# EAGLE schematic radio_module (EAGLE 8.2.0)
AUTHOR: Joshua Adkins; REV: B; TITLE: Radio Module

## Sheet 1 of 6: Module Headers and SAM4L
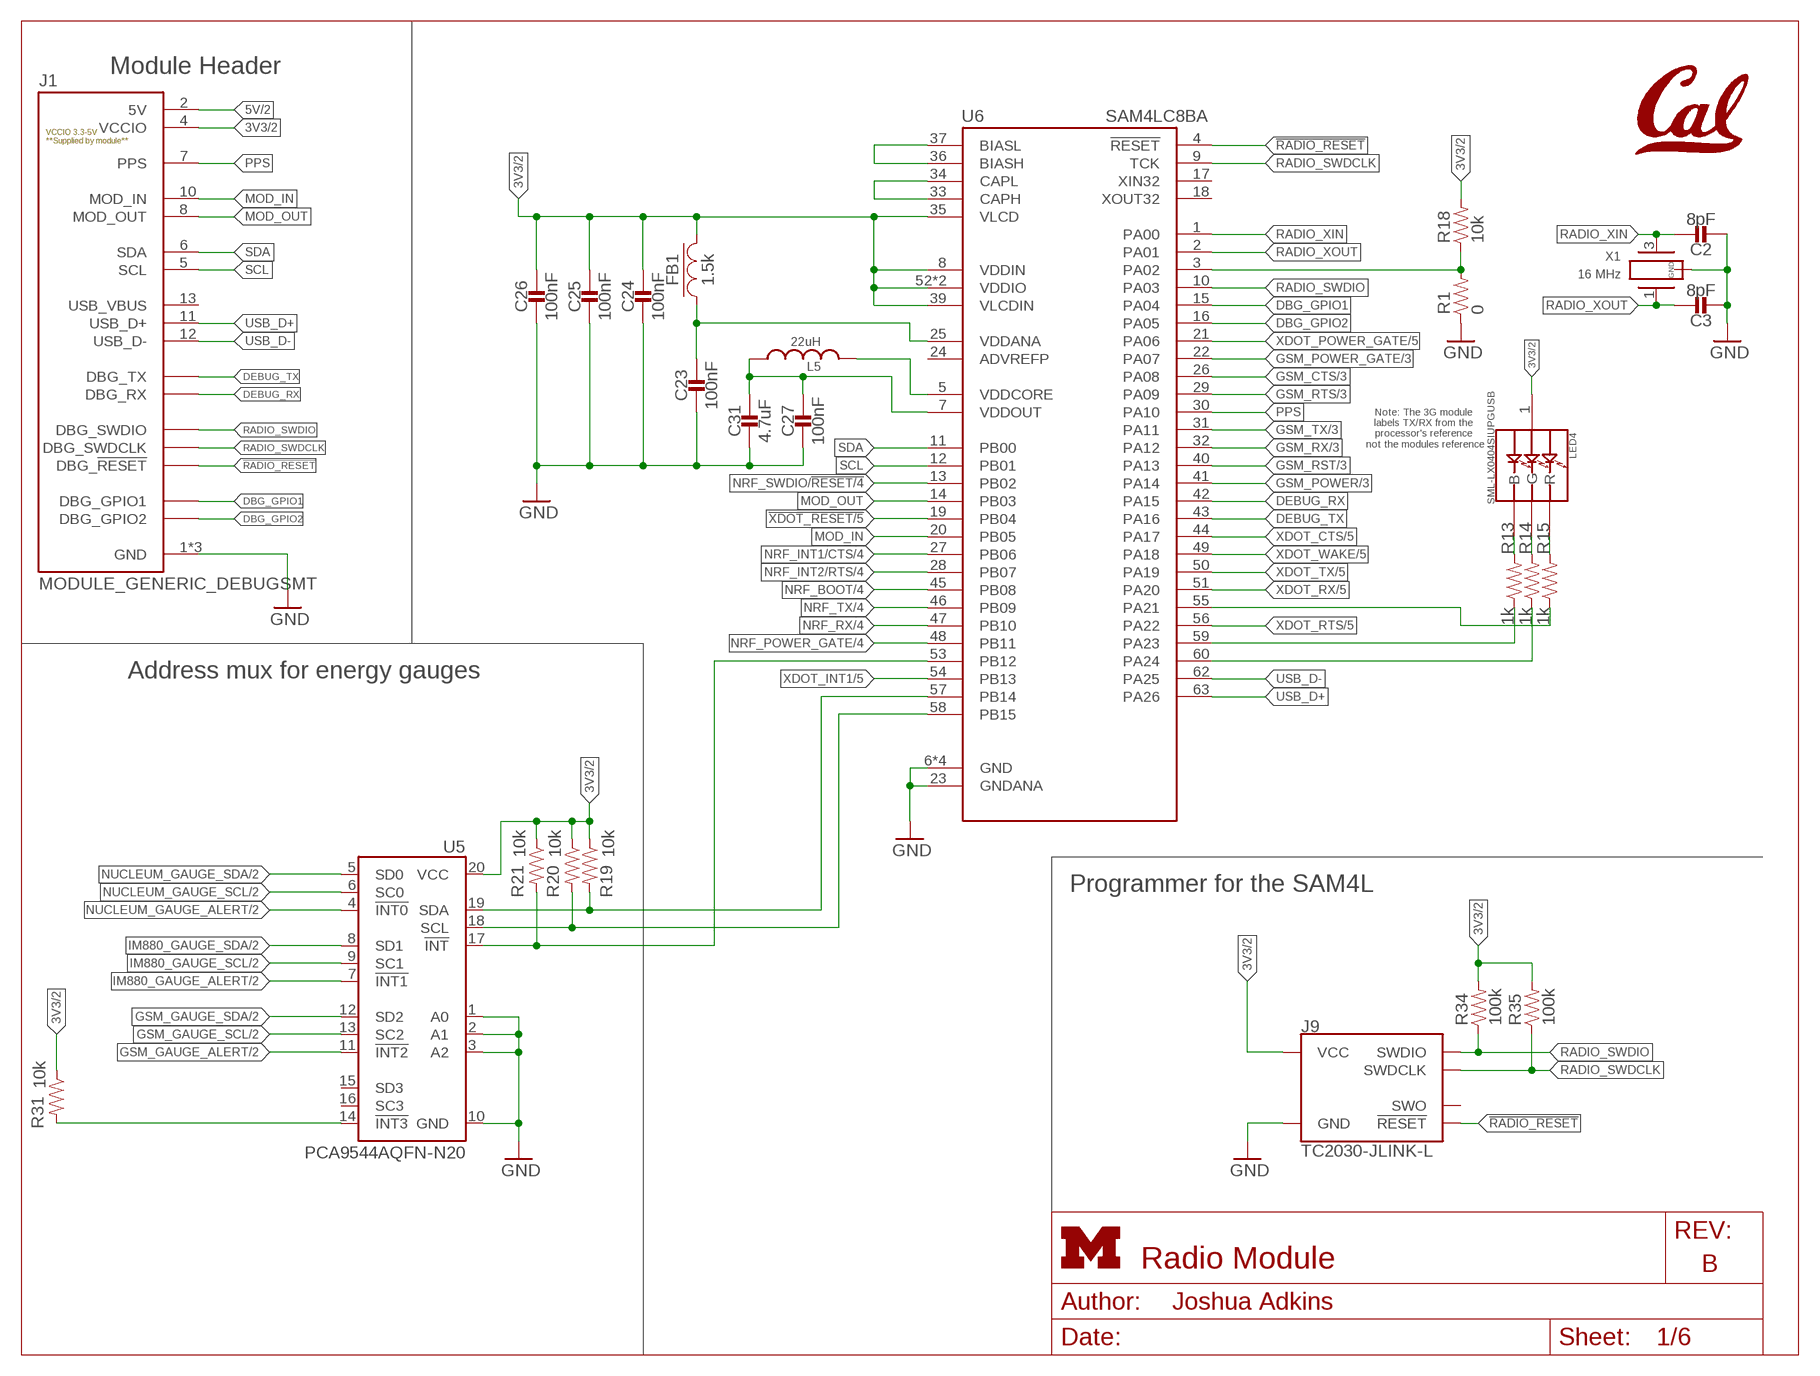
[diagram p0: schematic, sheet 1]
FRAME2 (LETTER_L_UMICH): HEIGHT: 8.5in; WIDTH: 11in

### Parts
C2  8pF  CAPACITOR0402_CAP  [0402_CAP]
C3  8pF  CAPACITOR0402_CAP  [0402_CAP]
C23  100nF  CAPACITOR0402_CAP  [0402_CAP]
C24  100nF  CAPACITOR0402_CAP  [0402_CAP]
C25  100nF  CAPACITOR0402_CAP  [0402_CAP]
C26  100nF  CAPACITOR0402_CAP  [0402_CAP]
C27  100nF  CAPACITOR0402_CAP  [0402_CAP]
C31  4.7uF  CAPACITOR0402_CAP  [0402_CAP]
FB1  1.5k  FERRITE_BEAD0402  [0402_CAP]
J1  MODULE_GENERIC_DEBUGSMT  [MODULE_GENERIC_DEBUG_SMT]
J9  TC2030-JLINK-L  [TC2030-IDC]
L5  22uH  LHQ3NP  [1212]
LED4  SML-LX0404SIUPGUSB  [1MM_SQ_4PAD]
R1  0  RESISTOR0402_RES  [0402_RES]
R13  1k  RESISTOR0402_RES  [0402_RES]
R14  1k  RESISTOR0402_RES  [0402_RES]
R15  1k  RESISTOR0402_RES  [0402_RES]
R18  10k  RESISTOR0402_RES  [0402_RES]
R19  10k  RESISTOR0402_RES  [0402_RES]
R20  10k  RESISTOR0402_RES  [0402_RES]
R21  10k  RESISTOR0402_RES  [0402_RES]
R31  10k  RESISTOR0402_RES  [0402_RES]
R34  100k  RESISTOR0402_RES  [0402_RES]
R35  100k  RESISTOR0402_RES  [0402_RES]
U5  PCA9544AQFN-N20  [QFN-N20]
U6  SAM4LC8BA  [QFN-64-9MM]
U$1  UCB_CAL100MIL  [UCB_CAL_100MIL]
X1  16 MHz  FH1600015  [FHXXX]

### Nets
3V3: C24.1 C25.1 C26.1 FB1.2 J1.4(VCCIO) J9.1(VCC) LED4.1(VDD) R18.2 R19.1 R20.1 R21.1 R31.1 R34.2 R35.2 U5.20(VCC) U6.8(VDDIN) U6.35(VLCD) U6.39(VLCDIN) U6.52(VDDIO) U6.61(VDDIO) ; also sheet 2,3
5V: J1.2(5V) ; also sheet 2
!RADIO_RESET: J1.20(DBG_!RESET) J9.3(!RESET) U6.4(!RESET)
!XDOT_RESET: U6.19(PB04) ; also sheet 5,6
CONTROLLER_BUCK/LDO_N: R1.2 R18.1 U6.3(PA02)
DBG_GPIO1: J1.16(DBG_GPIO1) U6.15(PA04)
DBG_GPIO2: J1.19(DBG_GPIO2) U6.16(PA05)
DEBUG_RX: J1.18(DBG_RX) U6.42(PA15)
DEBUG_TX: J1.17(DBG_TX) U6.43(PA16)
GND: C2.2 C3.2 C23.2 C24.2 C25.2 C26.2 C27.2 C31.2 J1.1(GND) J1.14(GND) J1.15(GND) J9.5(GND) R1.1 U5.1(A0) U5.2(A1) U5.3(A2) U5.10(GND) U6.6(GND) U6.23(GNDANA) U6.38(GND) U6.64(GND) U6.GND X1.2(GND) X1.4(GND) ; also sheet 2,3,4,5,6
GSM_CTS: U6.26(PA08) ; also sheet 3,6
GSM_GAUGE_ALERT: U5.11(!INT2) ; also sheet 2
GSM_GAUGE_SCL: U5.13(SC2) ; also sheet 2
GSM_GAUGE_SDA: U5.12(SD2) ; also sheet 2
GSM_POWER: U6.41(PA14) ; also sheet 3,6
GSM_POWER_GATE: U6.22(PA07) ; also sheet 3,6
GSM_RST: U6.40(PA13) ; also sheet 3,6
GSM_RTS: U6.29(PA09) ; also sheet 3,6
GSM_RX: U6.32(PA12) ; also sheet 3,6
GSM_TX: U6.31(PA11) ; also sheet 3,6
IM880_GAUGE_ALERT: U5.7(!INT1) ; also sheet 2
IM880_GAUGE_SCL: U5.9(SC1) ; also sheet 2
IM880_GAUGE_SDA: U5.8(SD1) ; also sheet 2
MOD_IN: J1.10(MOD_IN) U6.20(PB05)
MOD_OUT: J1.8(MOD_OUT) U6.14(PB03)
N$9: R21.2 U5.17(!INT) U6.53(PB12)
N$12: R31.2 U5.14(!INT3)
N$17: R13.1 U6.59(PA23)
N$18: LED4.3(B) R13.2
N$20: LED4.4(G) R14.2
N$21: LED4.2(R) R15.2
N$25: R14.1 U6.60(PA24)
N$26: R15.1 U6.55(PA21)
N$33: C23.1 FB1.1 U6.25(VDDANA)
N$44: C27.1 C31.1 L5.P$1 U6.7(VDDOUT)
N$52: L5.P$2 U6.5(VDDCORE)
N$53: U6.36(BIASH) U6.37(BIASL)
N$54: U6.33(CAPH) U6.34(CAPL)
NRF_BOOT: U6.45(PB08) ; also sheet 4,6
NRF_INT1/CTS: U6.27(PB06) ; also sheet 4,6
NRF_INT2/RTS: U6.28(PB07) ; also sheet 4,6
NRF_POWER_GATE: U6.48(PB11) ; also sheet 4,6
NRF_RX: U6.47(PB10) ; also sheet 4,6
NRF_SWDIO/!RESET: U6.13(PB02) ; also sheet 4,6
NRF_TX: U6.46(PB09) ; also sheet 4,6
NUCLEUM_GAUGE_ALERT: U5.4(!INT0) ; also sheet 2
NUCLEUM_GAUGE_SCL: U5.6(SC0) ; also sheet 2
NUCLEUM_GAUGE_SDA: U5.5(SD0) ; also sheet 2
PPS: J1.7(PPS) U6.30(PA10)
RADIO_SWDCLK: J1.21(DBG_SWDCLK) J9.4(SWDCLK) R35.1 U6.9(TCK)
RADIO_SWDIO: J1.22(DBG_SWDIO) J9.2(SWDIO) R34.1 U6.10(PA03)
RADIO_XIN: C2.1 U6.1(PA00) X1.3
RADIO_XOUT: C3.1 U6.2(PA01) X1.1
SCL: J1.5(SCL) U6.12(PB01)
SCL_INTERNAL: R20.2 U5.18(SCL) U6.58(PB15)
SDA: J1.6(SDA) U6.11(PB00)
SDA_INTERNAL: R19.2 U5.19(SDA) U6.57(PB14)
USB_D+: J1.11(USB_D+) U6.63(PA26)
USB_D-: J1.12(USB_D-) U6.62(PA25)
XDOT_CTS: U6.44(PA17) ; also sheet 5,6
XDOT_INT1: U6.54(PB13) ; also sheet 5,6
XDOT_POWER_GATE: U6.21(PA06) ; also sheet 5,6
XDOT_RTS: U6.56(PA22) ; also sheet 5,6
XDOT_RX: U6.51(PA20) ; also sheet 5,6
XDOT_TX: U6.50(PA19) ; also sheet 5,6
XDOT_WAKE: U6.49(PA18) ; also sheet 5,6
Unconnected: J1.13(USB_VBUS) J9.6(SWO) U5.15(SD3) U5.16(SC3) U6.17(XIN32) U6.18(XOUT32) U6.24(ADVREFP)

### Notes on the sheet
- Module Header
- Note: The 3G module 
  labels TX/RX from the 
  processor's reference 
  not the modules reference
- Address mux for energy gauges
- Programmer for the SAM4L

## Sheet 2 of 6: Regulators and power metering
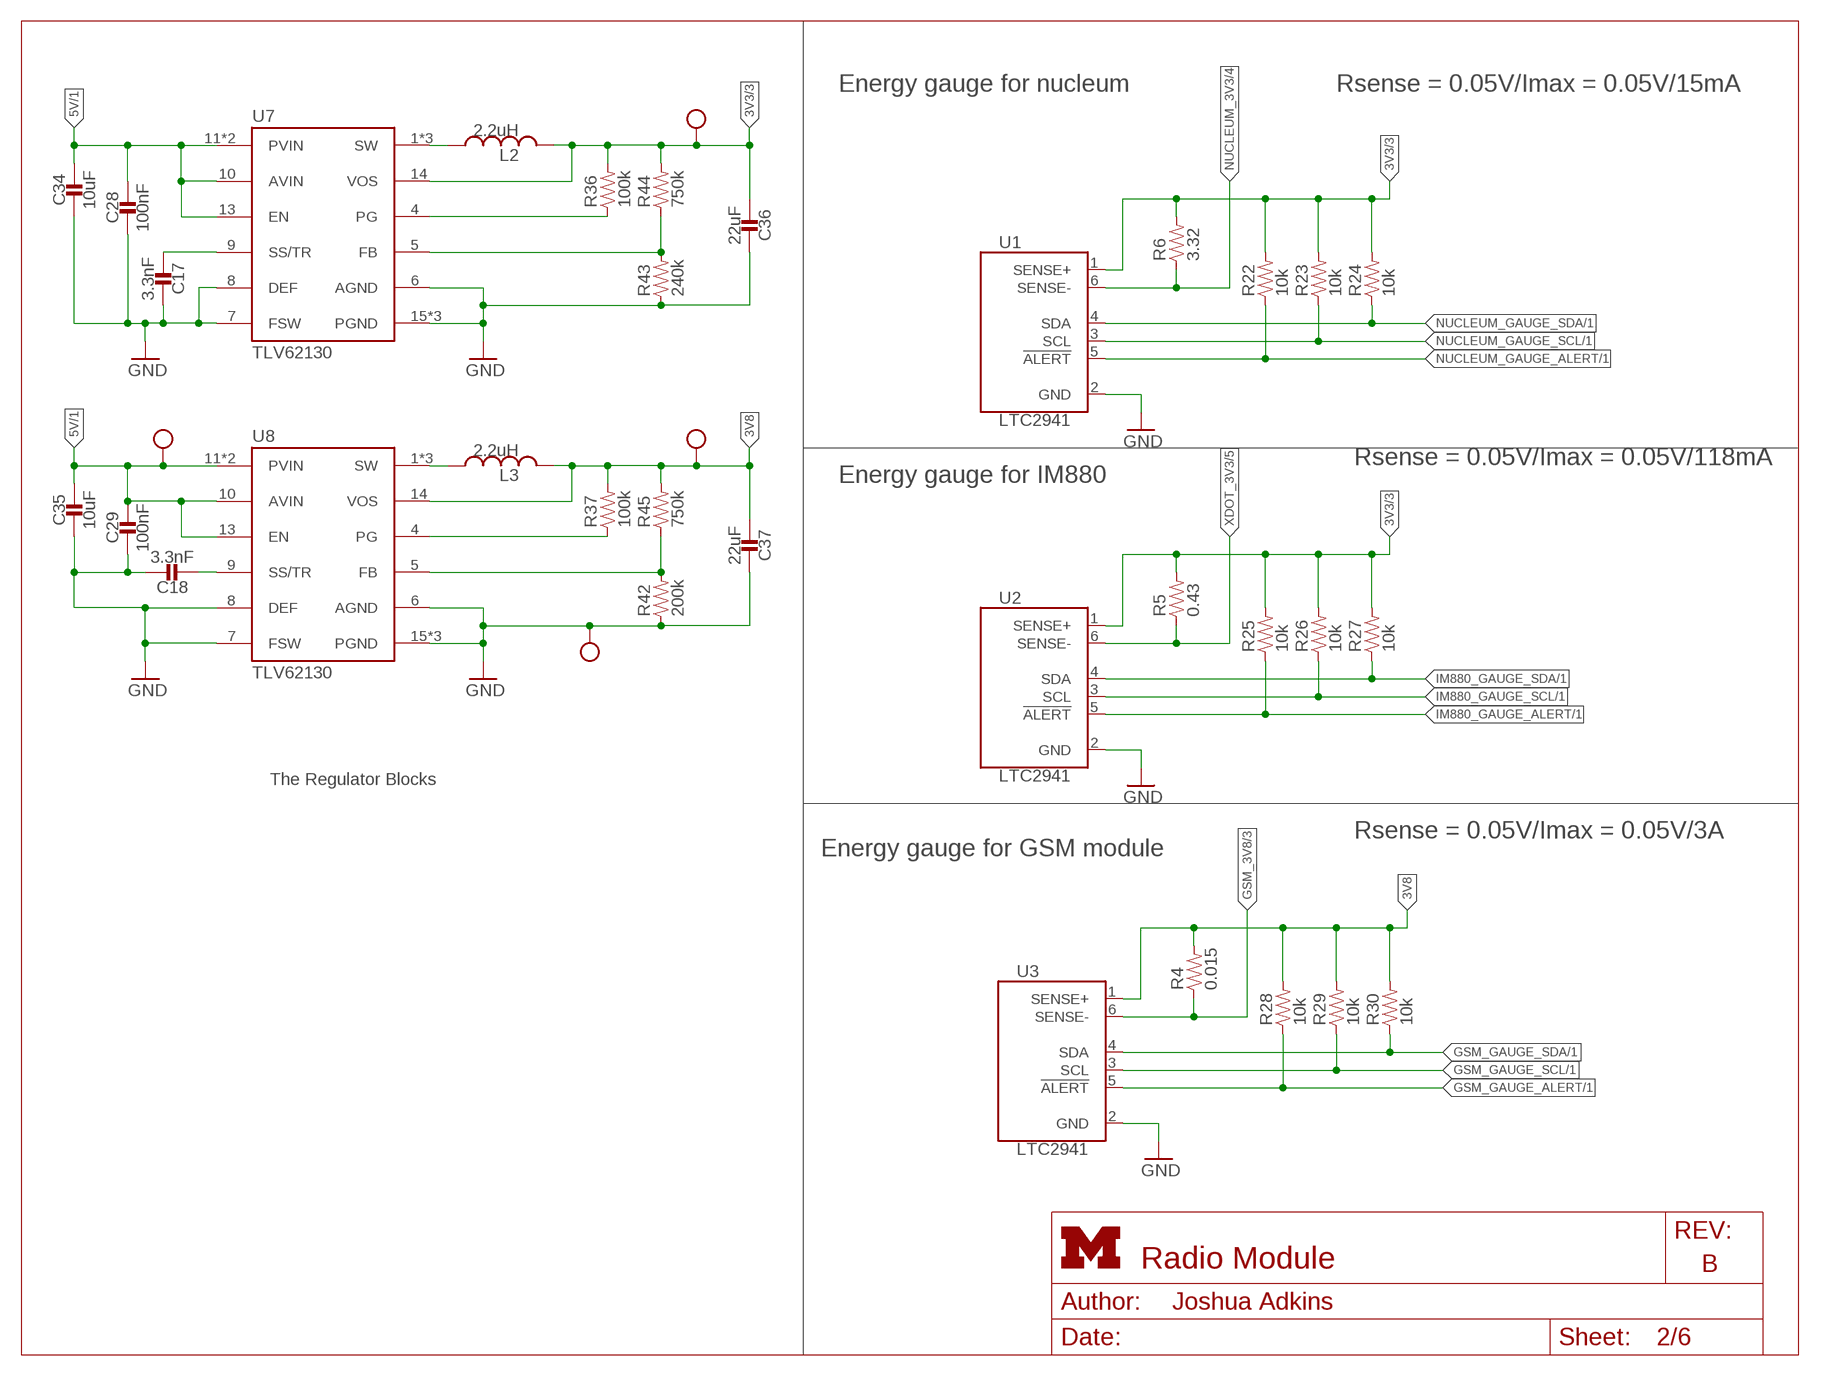
[diagram p1: schematic, sheet 2]
FRAME5 (LETTER_L_UMICH): HEIGHT: 8.5in; WIDTH: 11in

### Parts
C17  3.3nF  CAPACITOR0402_CAP  [0402_CAP]
C18  3.3nF  CAPACITOR0402_CAP  [0402_CAP]
C28  100nF  CAPACITOR0402_CAP  [0402_CAP]
C29  100nF  CAPACITOR0402_CAP  [0402_CAP]
C34  10uF  CAPACITOR0402_CAP  [0402_CAP]
C35  10uF  CAPACITOR0402_CAP  [0402_CAP]
C36  22uF  CAPACITOR0402_CAP  [0402_CAP]
C37  22uF  CAPACITOR0402_CAP  [0402_CAP]
L2  2.2uH  INDUCTORIHL  [IHL-1212BZ-11]
L3  2.2uH  INDUCTORIHL  [IHL-1212BZ-11]
R4  0.015  RESISTOR0603_RES  [0603-RES]
R5  0.43  RESISTOR0402_RES  [0402_RES]
R6  3.32  RESISTOR0402_RES  [0402_RES]
R22  10k  RESISTOR0402_RES  [0402_RES]
R23  10k  RESISTOR0402_RES  [0402_RES]
R24  10k  RESISTOR0402_RES  [0402_RES]
R25  10k  RESISTOR0402_RES  [0402_RES]
R26  10k  RESISTOR0402_RES  [0402_RES]
R27  10k  RESISTOR0402_RES  [0402_RES]
R28  10k  RESISTOR0402_RES  [0402_RES]
R29  10k  RESISTOR0402_RES  [0402_RES]
R30  10k  RESISTOR0402_RES  [0402_RES]
R36  100k  RESISTOR0402_RES  [0402_RES]
R37  100k  RESISTOR0402_RES  [0402_RES]
R42  200k  RESISTOR0402_RES  [0402_RES]
R43  240k  RESISTOR0402_RES  [0402_RES]
R44  750k  RESISTOR0402_RES  [0402_RES]
R45  750k  RESISTOR0402_RES  [0402_RES]
TP1  TEST_POINT_0.040IN  [TESTPOINT_0.040IN]
TP2  TEST_POINT_0.040IN  [TESTPOINT_0.040IN]
TP3  TEST_POINT_0.040IN  [TESTPOINT_0.040IN]
TP4  TEST_POINT_0.040IN  [TESTPOINT_0.040IN]
U1  LTC2941  [DFN-6-2MMX3MM]
U2  LTC2941  [DFN-6-2MMX3MM]
U3  LTC2941  [DFN-6-2MMX3MM]
U7  TLV62130  [TQFN-16/3MM]
U8  TLV62130  [TQFN-16/3MM]

### Nets
3V3: C36.2 L2.P$2 R5.2 R6.2 R22.2 R23.2 R24.2 R25.2 R26.2 R27.2 R36.2 R44.2 TP1.TESTPOINT U1.1(SENSE+) U2.1(SENSE+) U7.14(VOS) ; also sheet 1,3
3V8: C37.2 L3.P$2 R4.2 R28.2 R29.2 R30.2 R37.2 R45.2 TP2.TESTPOINT U3.1(SENSE+) U8.14(VOS)
3V8SWOUT: L3.P$1 U8.1(SW) U8.2(SW) U8.3(SW)
3VSWOUT: L2.P$1 U7.1(SW) U7.2(SW) U7.3(SW)
5V: C28.1 C29.1 C34.1 C35.1 TP4.TESTPOINT U7.10(AVIN) U7.11(PVIN) U7.12(PVIN) U7.13(EN) U8.10(AVIN) U8.11(PVIN) U8.12(PVIN) U8.13(EN) ; also sheet 1
GND: C17.1 C18.1 C28.2 C29.2 C34.2 C35.2 C36.1 C37.1 R42.1 R43.1 TP3.TESTPOINT U1.2(GND) U2.2(GND) U3.2(GND) U7.6(AGND) U7.7(FSW) U7.8(DEF) U7.15(PGND) U7.16(PGND) U7.GND U8.6(AGND) U8.7(FSW) U8.8(DEF) U8.15(PGND) U8.16(PGND) U8.GND ; also sheet 1,3,4,5,6
GSM_3V8: R4.1 U3.6(SENSE-) ; also sheet 3
GSM_GAUGE_ALERT: R28.1 U3.5(!ALERT) ; also sheet 1
GSM_GAUGE_SCL: R29.1 U3.3(SCL) ; also sheet 1
GSM_GAUGE_SDA: R30.1 U3.4(SDA) ; also sheet 1
IM880_GAUGE_ALERT: R25.1 U2.5(!ALERT) ; also sheet 1
IM880_GAUGE_SCL: R26.1 U2.3(SCL) ; also sheet 1
IM880_GAUGE_SDA: R27.1 U2.4(SDA) ; also sheet 1
N$34: C17.2 U7.9(SS/TR)
N$36: R36.1 U7.4(PG)
N$37: R43.2 R44.1 U7.5(FB)
N$38: C18.2 U8.9(SS/TR)
N$40: R37.1 U8.4(PG)
N$41: R42.2 R45.1 U8.5(FB)
NUCLEUM_3V3: R6.1 U1.6(SENSE-) ; also sheet 4
NUCLEUM_GAUGE_ALERT: R22.1 U1.5(!ALERT) ; also sheet 1
NUCLEUM_GAUGE_SCL: R23.1 U1.3(SCL) ; also sheet 1
NUCLEUM_GAUGE_SDA: R24.1 U1.4(SDA) ; also sheet 1
XDOT_3V3: R5.1 U2.6(SENSE-) ; also sheet 5

### Notes on the sheet
- Energy gauge for nucleum | Rsense = 0.05V/Imax = 0.05V/15mA
- Rsense = 0.05V/Imax = 0.05V/118mA
- Energy gauge for IM880
- The Regulator Blocks
- Rsense = 0.05V/Imax = 0.05V/3A
- Energy gauge for GSM module

## Sheet 3 of 6: 3G Radio Module
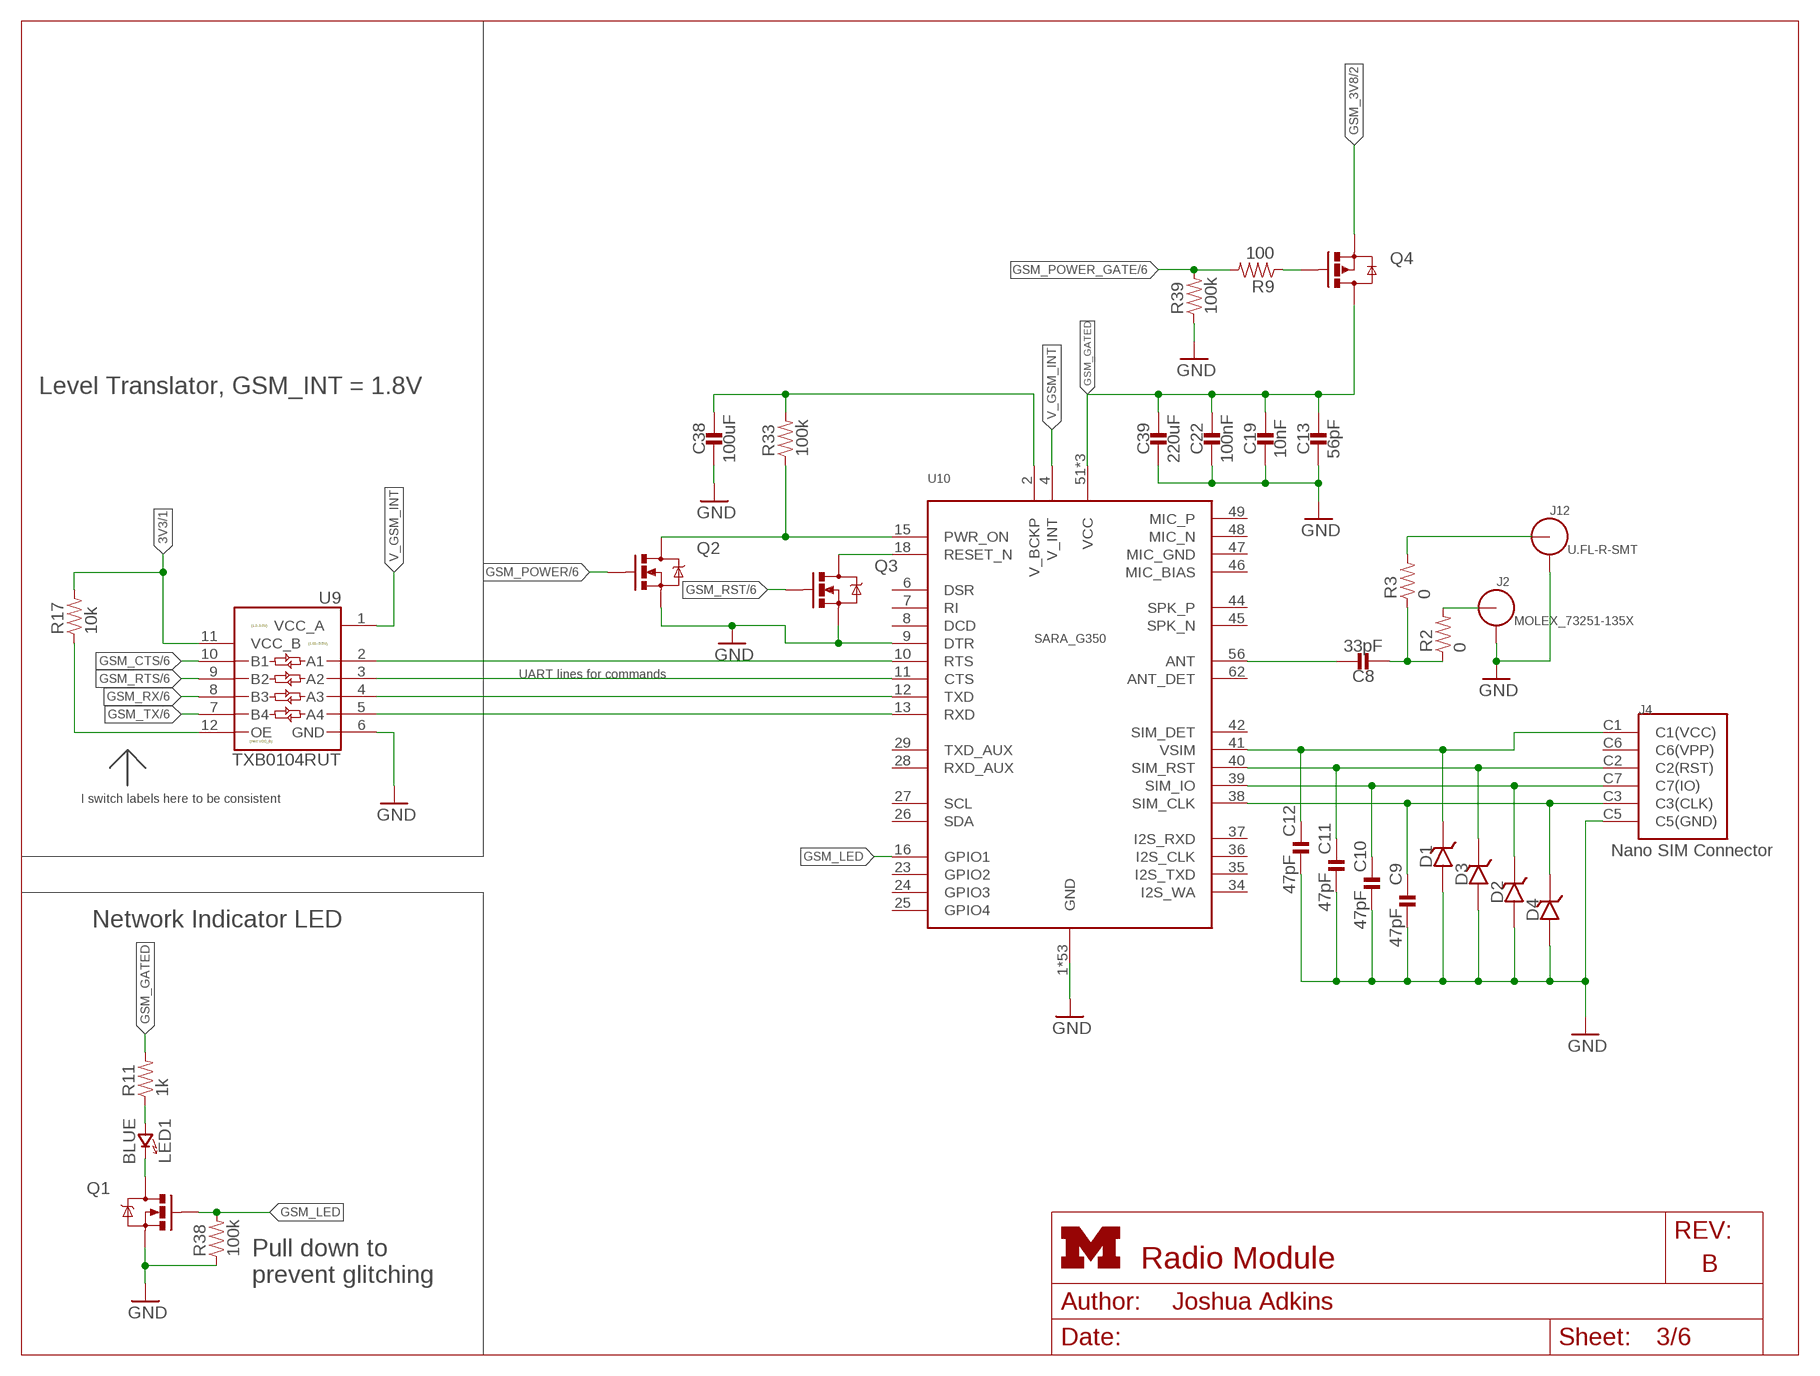
[diagram p2: schematic, sheet 3]
FRAME1 (LETTER_L_UMICH): HEIGHT: 8.5in; WIDTH: 11in

### Parts
C8  33pF  CAPACITOR0603_CAP  [0603_CAP]
C9  47pF  CAPACITOR0402_CAP  [0402_CAP]
C10  47pF  CAPACITOR0402_CAP  [0402_CAP]
C11  47pF  CAPACITOR0402_CAP  [0402_CAP]
C12  47pF  CAPACITOR0402_CAP  [0402_CAP]
C13  56pF  CAPACITOR0402_CAP  [0402_CAP]
C19  10nF  CAPACITOR0402_CAP  [0402_CAP]
C22  100nF  CAPACITOR0402_CAP  [0402_CAP]
C38  100uF  CAPACITOR0805_CAP  [0805_CAP]
C39  220uF  CAPACITOR1210_CAP  [1210_CAP]
D1  14V  DIODE_ZENER0402  [0402_DIODE]
D2  14V  DIODE_ZENER0402  [0402_DIODE]
D3  14V  DIODE_ZENER0402  [0402_DIODE]
D4  14V  DIODE_ZENER0402  [0402_DIODE]
J2  MOLEX_73251-135X  [SMA-J/PCB]
J4  NANO_SIM  [WURTH_NANO_SIM]
J12  U.FL-R-SMT  [U.FL_SMT]
LED1  BLUE  LED0603  [LED-0603]
Q1  MOSFET-NCHANNELSMD  [SOT23-3]
Q2  MOSFET-NCHANNELSMD  [SOT23-3]
Q3  MOSFET-NCHANNELSMD  [SOT23-3]
Q4  SI223DDS  [SOT23-3]
R2  0  RESISTOR0402_RES  [0402_RES]
R3  0  RESISTOR0402_RES  [0402_RES]
R9  100  RESISTOR0402_RES  [0402_RES]
R11  1k  RESISTOR0402_RES  [0402_RES]
R17  10k  RESISTOR0402_RES  [0402_RES]
R33  100k  RESISTOR0402_RES  [0402_RES]
R38  100k  RESISTOR0402_RES  [0402_RES]
R39  100k  RESISTOR0402_RES  [0402_RES]
U9  TXB0104RUT  [UQFN-12]
U10  UBLOX_SARA_G350  [UBLOX_SARA_G3]

### Nets
3V3: R17.2 U9.11(VCC_B) ; also sheet 1,2
GND: C9.2 C10.2 C11.2 C12.2 C13.2 C19.2 C22.2 C38.P$2 C39.2 D1.ANODE D2.ANODE D3.ANODE D4.ANODE J2.2 J2.3 J2.4 J2.5 J4.C5(C5(GND)) J12.GND1 J12.GND2 Q1.2(S) Q2.2(S) Q3.2(S) R38.1 R39.1 U9.6(GND) U10.1(GND) U10.3(GND) U10.5(GND) U10.9(DTR) U10.14(GND) U10.20(GND) U10.21(GND) U10.22(GND) U10.30(GND) U10.32(GND) U10.33(GND) U10.43(GND) U10.50(GND) U10.54(GND) U10.55(GND) U10.57(GND) U10.58(GND) U10.59(GND) U10.60(GND) U10.61(GND) U10.63(GND) U10.64(GND) U10.65(GND) U10.66(GND) U10.67(GND) U10.68(GND) U10.69(GND) U10.70(GND) U10.71(GND) U10.72(GND) U10.73(GND) U10.74(GND) U10.75(GND) U10.76(GND) U10.77(GND) U10.78(GND) U10.79(GND) U10.80(GND) U10.81(GND) U10.82(GND) U10.83(GND) U10.84(GND) U10.85(GND) U10.86(GND) U10.87(GND) U10.88(GND) U10.89(GND) U10.90(GND) U10.91(GND) U10.92(GND) U10.93(GND) U10.94(GND) U10.95(GND) U10.96(GND) ; also sheet 1,2,4,5,6
GSM_3V8: Q4.2(S) ; also sheet 2
GSM_CTS: U9.10(B1) ; also sheet 1,6
GSM_GATED: C13.1 C19.1 C22.1 C39.1 Q4.3(D) R11.2 U10.51(VCC) U10.52(VCC) U10.53(VCC)
GSM_LED: Q1.1(G) R38.2 U10.16(GPIO1)
GSM_POWER: Q2.1(G) ; also sheet 1,6
GSM_POWER_GATE: R9.2 R39.2 ; also sheet 1,6
GSM_RST: Q3.1(G) ; also sheet 1,6
GSM_RTS: U9.9(B2) ; also sheet 1,6
GSM_RX: U9.8(B3) ; also sheet 1,6
GSM_TX: U9.7(B4) ; also sheet 1,6
N$1: C12.1 D1.CATHODE J4.C1(C1(VCC)) U10.41(VSIM)
N$2: C11.1 D3.CATHODE J4.C2(C2(RST)) U10.40(SIM_RST)
N$3: C10.1 D2.CATHODE J4.C7(C7(IO)) U10.39(SIM_IO)
N$4: C9.1 D4.CATHODE J4.C3(C3(CLK)) U10.38(SIM_CLK)
N$5: R17.1 U9.12(OE)
N$6: C8.1 U10.56(ANT)
N$7: J12.SIG(ANT) R3.2
N$8: LED1.A(ANODE) R11.1
N$10: U9.4(A3) U10.12(TXD)
N$11: U9.5(A4) U10.13(RXD)
N$13: LED1.C(CATHODE) Q1.3(D)
N$14: Q3.3(D) U10.18(RESET_N)
N$15: C38.P$1 R33.2 U10.2(V_BCKP)
N$16: Q2.3(D) R33.1 U10.15(PWR_ON)
N$22: U9.3(A2) U10.11(CTS)
N$23: U9.2(A1) U10.10(RTS)
N$29: C8.2 R2.1 R3.1
N$30: J2.1(ANT) R2.2
N$31: Q4.1(G) R9.1
V_GSM_INT: U9.1(VCC_A) U10.4(V_INT)
Unconnected: J4.C6(C6(VPP)) U10.6(DSR) U10.7(RI) U10.8(DCD) U10.23(GPIO2) U10.24(GPIO3) U10.25(GPIO4) U10.26(SDA) U10.27(SCL) U10.28(RXD_AUX) U10.29(TXD_AUX) U10.34(I2S_WA) U10.35(I2S_TXD) U10.36(I2S_CLK) U10.37(I2S_RXD) U10.42(SIM_DET) U10.44(SPK_P) U10.45(SPK_N) U10.46(MIC_BIAS) U10.47(MIC_GND) U10.48(MIC_N) U10.49(MIC_P) U10.62(ANT_DET)

### Notes on the sheet
- Level Translator, GSM_INT = 1.8V
- UART lines for commands
- I switch labels here to be consistent
- Network Indicator LED
- Pull down to 
  prevent glitching

## Sheet 4 of 6: Bluetooth Module
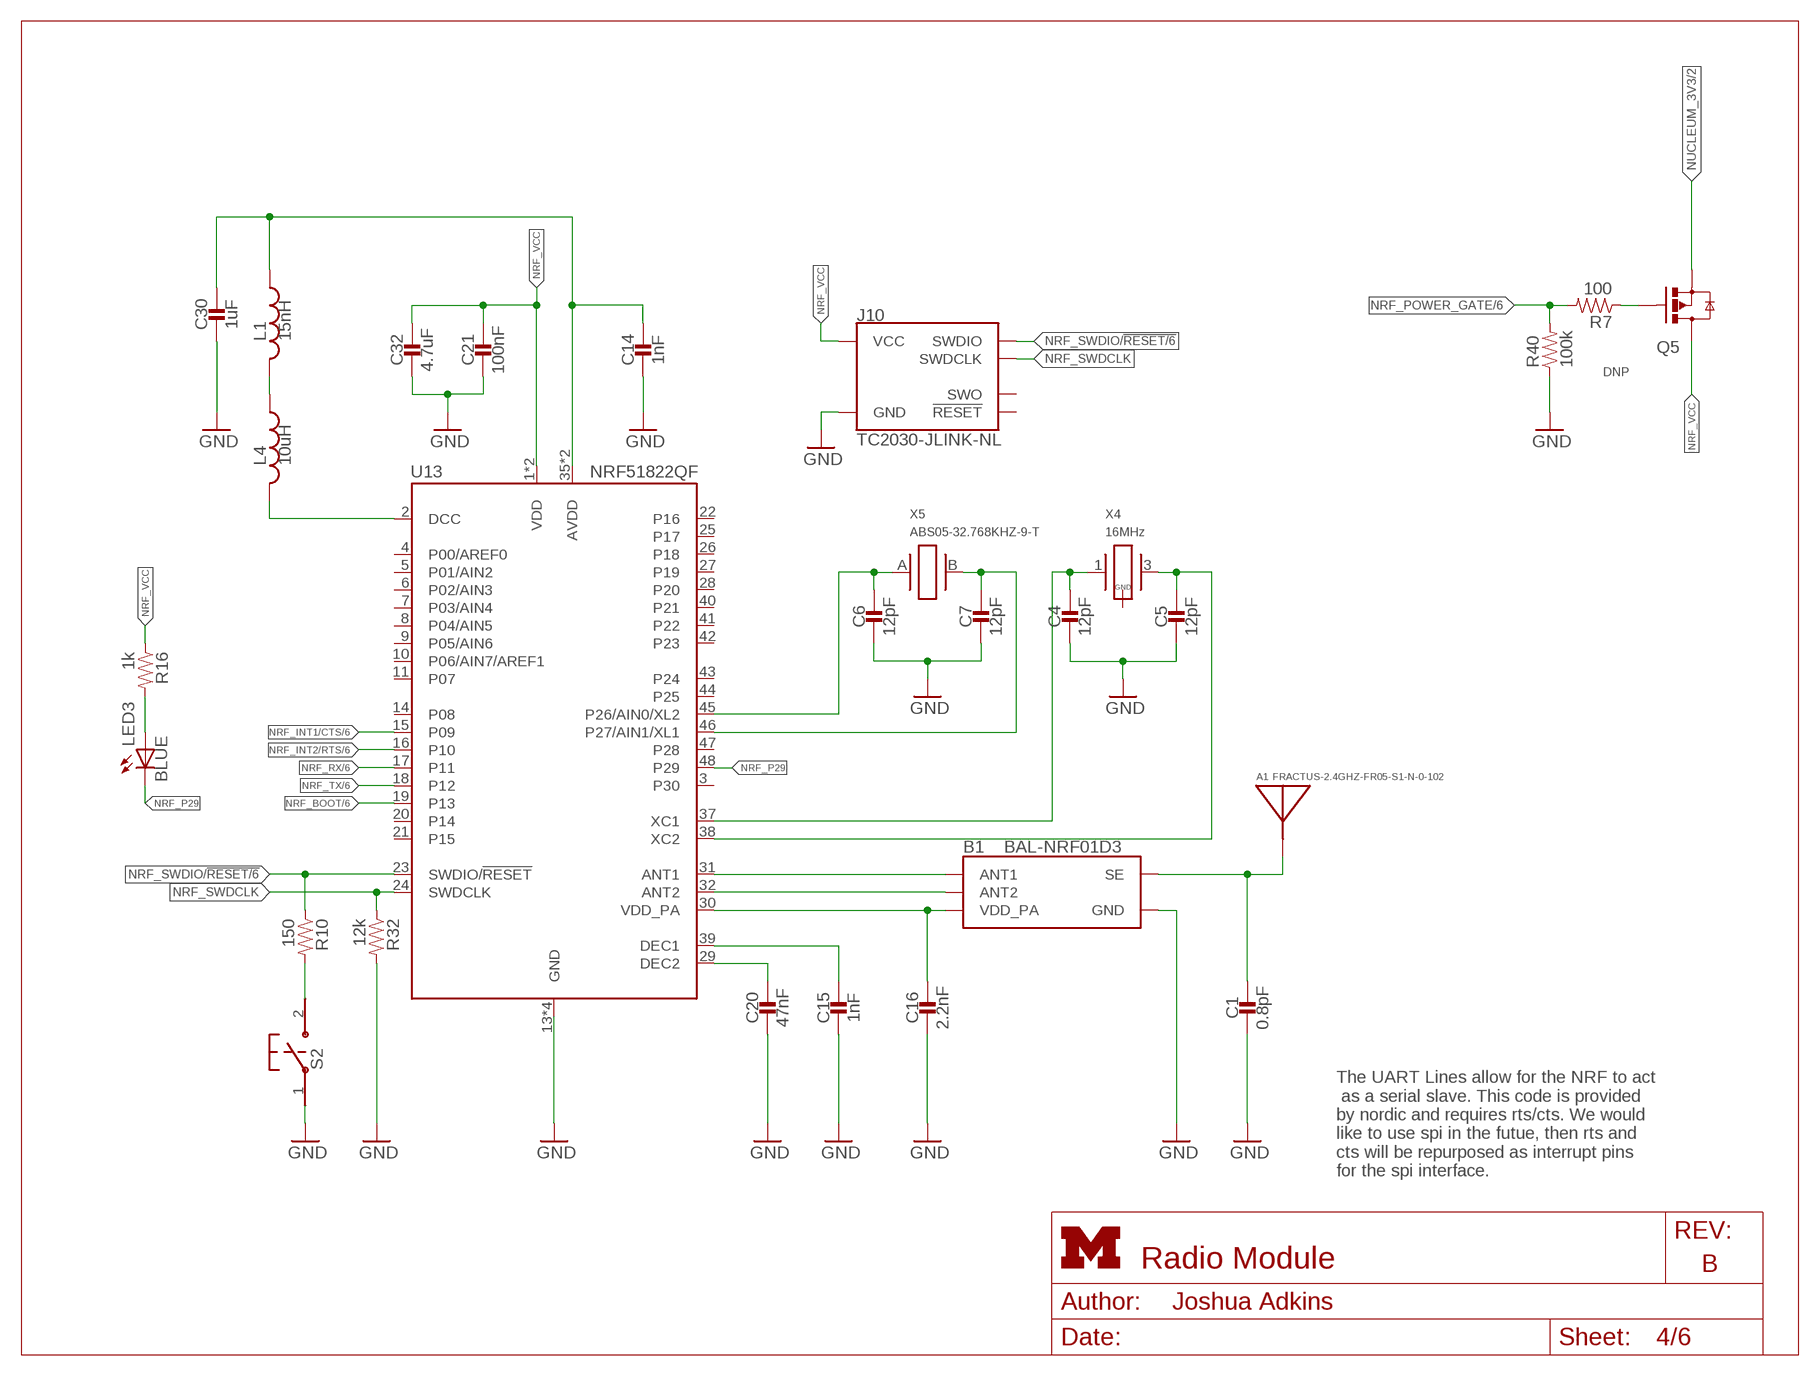
[diagram p3: schematic, sheet 4]
FRAME3 (LETTER_L_UMICH): HEIGHT: 8.5in; WIDTH: 11in

### Parts
A1  FRACTUS-2.4GHZ-FR05-S1-N-0-102  [FRACTUS-ANTENNA-FR05-S1-N-0-102]
B1  BAL-NRF01D3  [BAL-NRF01D3]
C1  0.8pF  CAPACITOR0402_CAP  [0402_CAP]
C4  12pF  CAPACITOR0402_CAP  [0402_CAP]
C5  12pF  CAPACITOR0402_CAP  [0402_CAP]
C6  12pF  CAPACITOR0402_CAP  [0402_CAP]
C7  12pF  CAPACITOR0402_CAP  [0402_CAP]
C14  1nF  CAPACITOR0402_CAP  [0402_CAP]
C15  1nF  CAPACITOR0402_CAP  [0402_CAP]
C16  2.2nF  CAPACITOR0402_CAP  [0402_CAP]
C20  47nF  CAPACITOR0402_CAP  [0402_CAP]
C21  100nF  CAPACITOR0402_CAP  [0402_CAP]
C30  1uF  CAPACITOR0402_CAP  [0402_CAP]
C32  4.7uF  CAPACITOR0402_CAP  [0402_CAP]
J10  TC2030-JLINK-NL  [TC2030-IDC-NL]
L1  15nH  INDUCTOR0402  [0402_CAP]
L4  10uH  INDUCTOR0603  [0603_CAP]
LED3  BLUE  LED0603  [LED-0603]
Q5  SI223DDS  [SOT23-3]
R7  100  RESISTOR0402_RES  [0402_RES]
R10  150  RESISTOR0402_RES  [0402_RES]
R16  1k  RESISTOR0402_RES  [0402_RES]
R32  12k  RESISTOR0402_RES  [0402_RES]
R40  100k  RESISTOR0402_RES  [0402_RES]
S2  B3U-1000P  [B3U-1000P]
U13  NRF51822QF  [QFN-48-6MM]
X4  16MHz  TXC-8Y  [TXC-8Y]
X5  ABS05-32.768KHZ-9-T  [ABS05]

### Nets
AVDD1: C14.1 C30.1 L1.1 U13.35(AVDD) U13.36(AVDD)
DCC1: L4.2 U13.2(DCC)
GND: B1.GND C1.2 C4.2 C5.2 C6.2 C7.2 C14.2 C15.2 C16.2 C20.2 C21.2 C30.2 C32.2 J10.5(GND) R32.2 R40.1 S2.1 U13.13(GND) U13.33(GND) U13.34(GND) U13.GND ; also sheet 1,2,3,5,6
N$32: Q5.1(G) R7.1
N$57: B1.ANT1 U13.31(ANT1)
N$58: B1.ANT2 U13.32(ANT2)
N$59: A1.1(ANTENNA) B1.SE C1.1
N$60: L1.2 L4.1
N$61: C4.1 U13.37(XC1) X4.1
N$62: C5.1 U13.38(XC2) X4.3
N$63: C15.1 U13.39(DEC1)
N$64: C20.1 U13.29(DEC2)
N$65: LED3.A R16.2
N$66: R10.2 S2.2
NRF_A2: C7.1 U13.46(P27/AIN1/XL1) X5.B
NRF_A3: C6.1 U13.45(P26/AIN0/XL2) X5.A
NRF_BOOT: U13.19(P13) ; also sheet 1,6
NRF_INT1/CTS: U13.15(P09) ; also sheet 1,6
NRF_INT2/RTS: U13.16(P10) ; also sheet 1,6
NRF_P29: LED3.C U13.48(P29)
NRF_POWER_GATE: R7.2 R40.2 ; also sheet 1,6
NRF_RX: U13.17(P11) ; also sheet 1,6
NRF_SWDCLK: J10.4(SWDCLK) R32.1 U13.24(SWDCLK)
NRF_SWDIO/!RESET: J10.2(SWDIO) R10.1 U13.23(SWDIO/!RESET) ; also sheet 1,6
NRF_TX: U13.18(P12) ; also sheet 1,6
NRF_VCC: C21.1 C32.1 J10.1(VCC) Q5.3(D) R16.1 U13.1(VDD) U13.12(VDD)
NUCLEUM_3V3: Q5.2(S) ; also sheet 2
VDD_PA1: B1.VCC(VDD_PA) C16.1 U13.30(VDD_PA)
Unconnected: J10.3(!RESET) J10.6(SWO) U13.3(P30) U13.4(P00/AREF0) U13.5(P01/AIN2) U13.6(P02/AIN3) U13.7(P03/AIN4) U13.8(P04/AIN5) U13.9(P05/AIN6) U13.10(P06/AIN7/AREF1) U13.11(P07) U13.14(P08) U13.20(P14) U13.21(P15) U13.22(P16) U13.25(P17) U13.26(P18) U13.27(P19) U13.28(P20) U13.40(P21) U13.41(P22) U13.42(P23) U13.43(P24) U13.44(P25) U13.47(P28) X4.2(GND) X4.4(GND)

### Notes on the sheet
- DNP
- The UART Lines allow for the NRF to act
   as a serial slave. This code is provided 
  by nordic and requires rts/cts. We would 
  like to use spi in the futue, then rts and 
  cts will be repurposed as interrupt pins 
  for the spi interface.

## Sheet 5 of 6: Lora Module and Programming
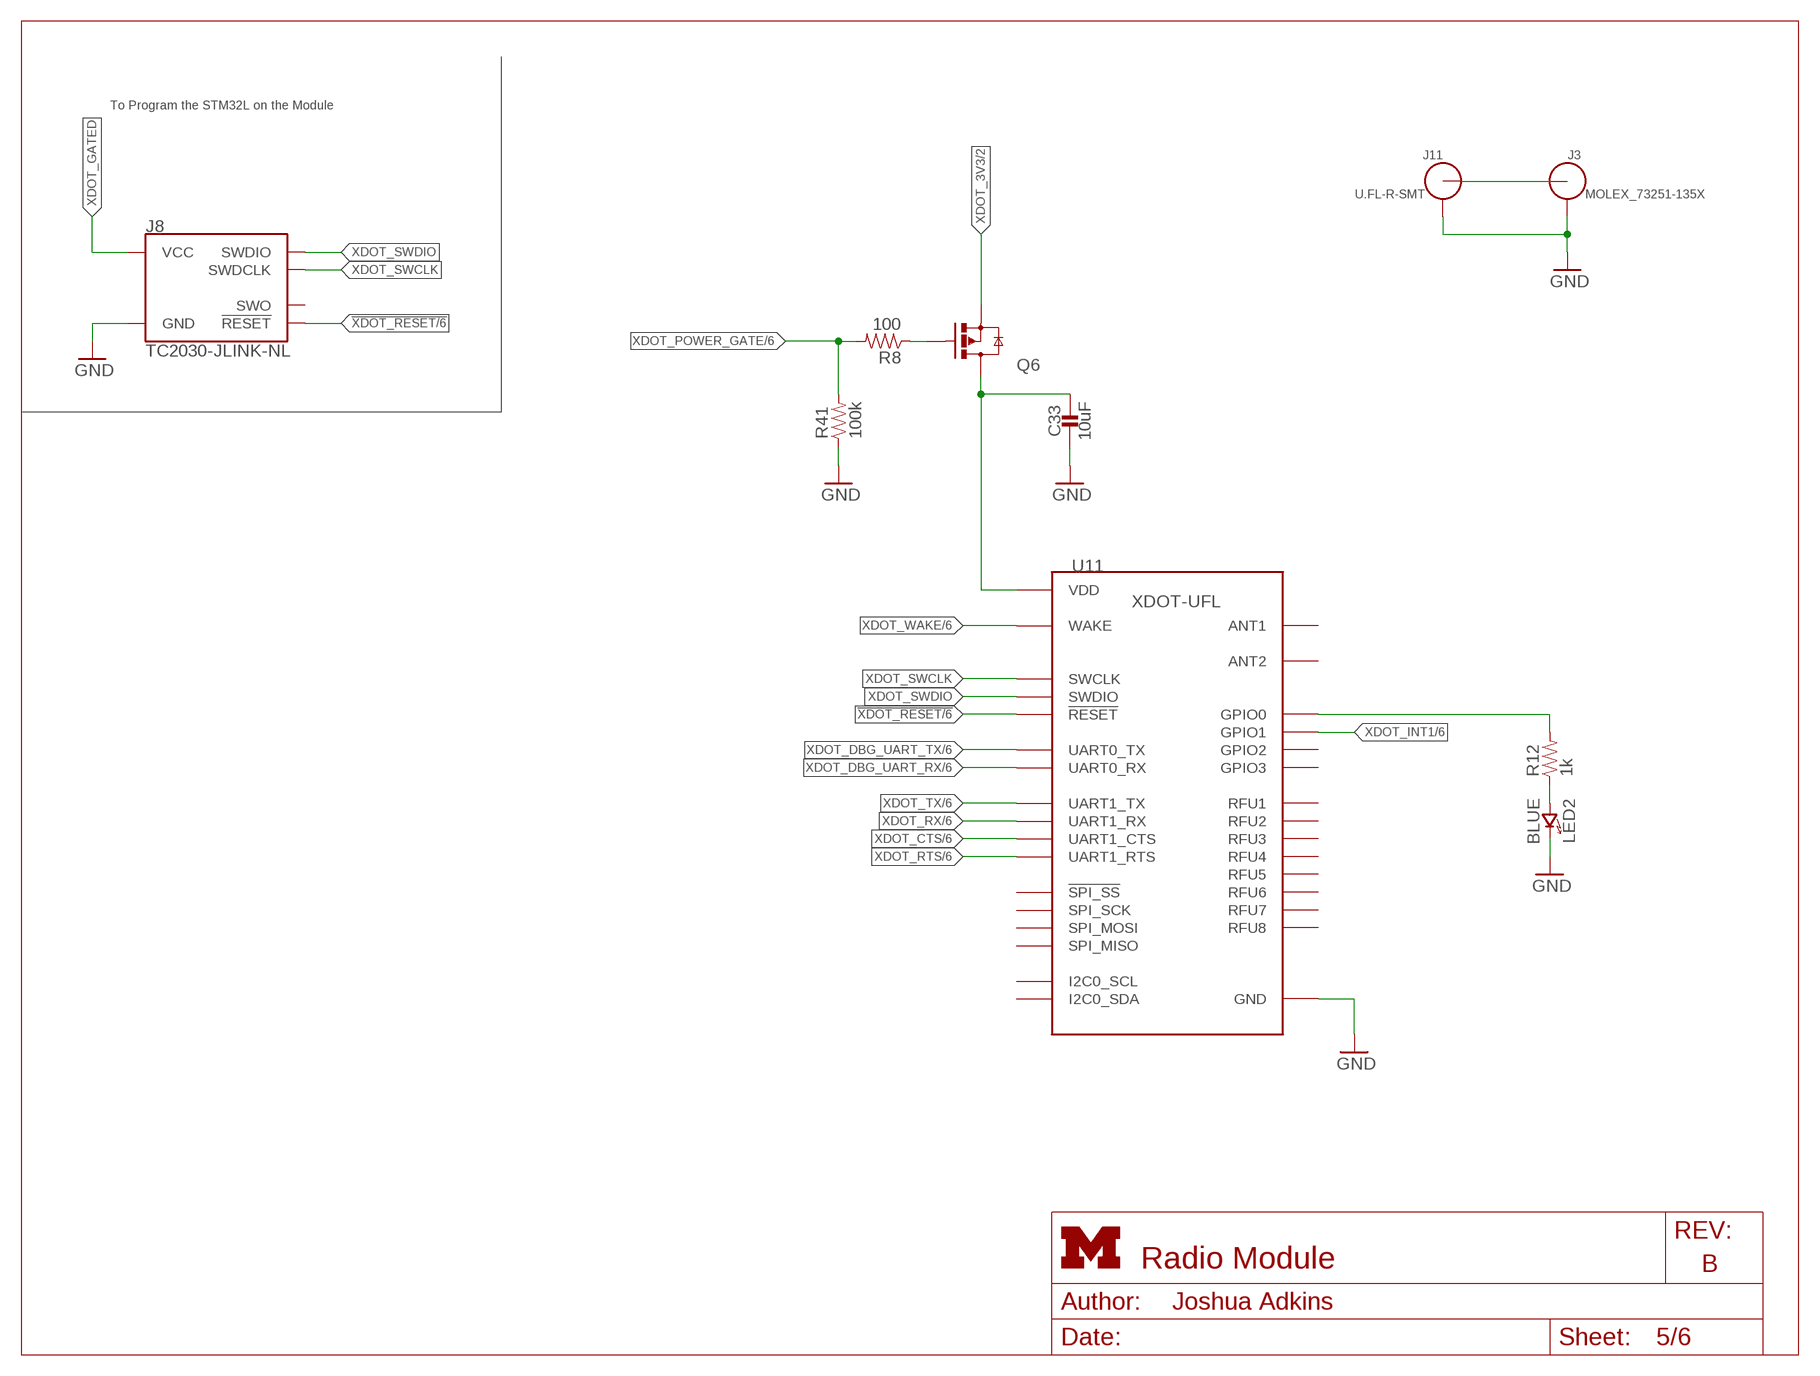
[diagram p4: schematic, sheet 5]
FRAME4 (LETTER_L_UMICH): HEIGHT: 8.5in; WIDTH: 11in

### Parts
C33  10uF  CAPACITOR0402_CAP  [0402_CAP]
J3  MOLEX_73251-135X  [SMA-J/PCB]
J8  TC2030-JLINK-NL  [TC2030-IDC-NL]
J11  U.FL-R-SMT  [U.FL_SMT]
LED2  BLUE  LED0603  [LED-0603]
Q6  SI223DDS  [SOT23-3]
R8  100  RESISTOR0402_RES  [0402_RES]
R12  1k  RESISTOR0402_RES  [0402_RES]
R41  100k  RESISTOR0402_RES  [0402_RES]
U11  XDOT_MODULE  [XDOT_MODULE]

### Nets
!XDOT_RESET: J8.3(!RESET) U11.P$33(!RESET) ; also sheet 1,6
GND: C33.2 J3.2 J3.3 J3.4 J3.5 J8.5(GND) J11.GND1 J11.GND2 LED2.C(CATHODE) R41.1 U11.P$1(GND) U11.P$5(GND) U11.P$17(GND) U11.P$20(GND) U11.P$35(GND) U11.P$36(GND) U11.P$38(GND) U11.P$39(GND) U11.P$40(GND) U11.P$41(GND) U11.P$42(GND) U11.P$43(GND) U11.P$44(GND) U11.P$45(GND) U11.P$46(GND) U11.P$48(GND) U11.P$49(GND) U11.P$50(GND) U11.P$51(GND) U11.P$52(GND) U11.P$53(GND) U11.P$54(GND) U11.P$55(GND) U11.P$56(GND) U11.P$57(GND) U11.P$58(GND) ; also sheet 1,2,3,4,6
N$24: J3.1(ANT) J11.SIG(ANT)
N$27: LED2.A(ANODE) R12.1
N$28: Q6.1(G) R8.1
XDOT_3V3: Q6.2(S) ; also sheet 2
XDOT_CTS: U11.P$32(UART1_CTS) ; also sheet 1,6
XDOT_DBG_UART_RX: U11.P$16(UART0_RX) ; also sheet 6
XDOT_DBG_UART_TX: U11.P$15(UART0_TX) ; also sheet 6
XDOT_GATED: C33.1 J8.1(VCC) Q6.3(D) U11.P$3(VDD) U11.P$4(VDD)
XDOT_GPIO0: R12.2 U11.P$26(GPIO0)
XDOT_INT1: U11.P$25(GPIO1) ; also sheet 1,6
XDOT_POWER_GATE: R8.2 R41.2 ; also sheet 1,6
XDOT_RTS: U11.P$31(UART1_RTS) ; also sheet 1,6
XDOT_RX: U11.P$14(UART1_RX) ; also sheet 1,6
XDOT_SWCLK: J8.4(SWDCLK) U11.P$29(SWCLK)
XDOT_SWDIO: J8.2(SWDIO) U11.P$30(SWDIO)
XDOT_TX: U11.P$13(UART1_TX) ; also sheet 1,6
XDOT_WAKE: U11.P$34(WAKE) ; also sheet 1,6
Unconnected: J8.6(SWO) U11.P$2(RFU1) U11.P$6(RFU2) U11.P$7(RFU3) U11.P$8(RFU4) U11.P$9(!SPI_SS) U11.P$10(SPI_SCK) U11.P$11(SPI_MOSI) U11.P$12(SPI_MISO) U11.P$18(RFU5) U11.P$19(RFU6) U11.P$21(RFU7) U11.P$22(RFU8) U11.P$23(GPIO3) U11.P$24(GPIO2) U11.P$27(I2C0_SCL) U11.P$28(I2C0_SDA) U11.P$37(ANT1) U11.P$47(ANT2)

### Notes on the sheet
- To Program the STM32L on the Module

## Sheet 6 of 6
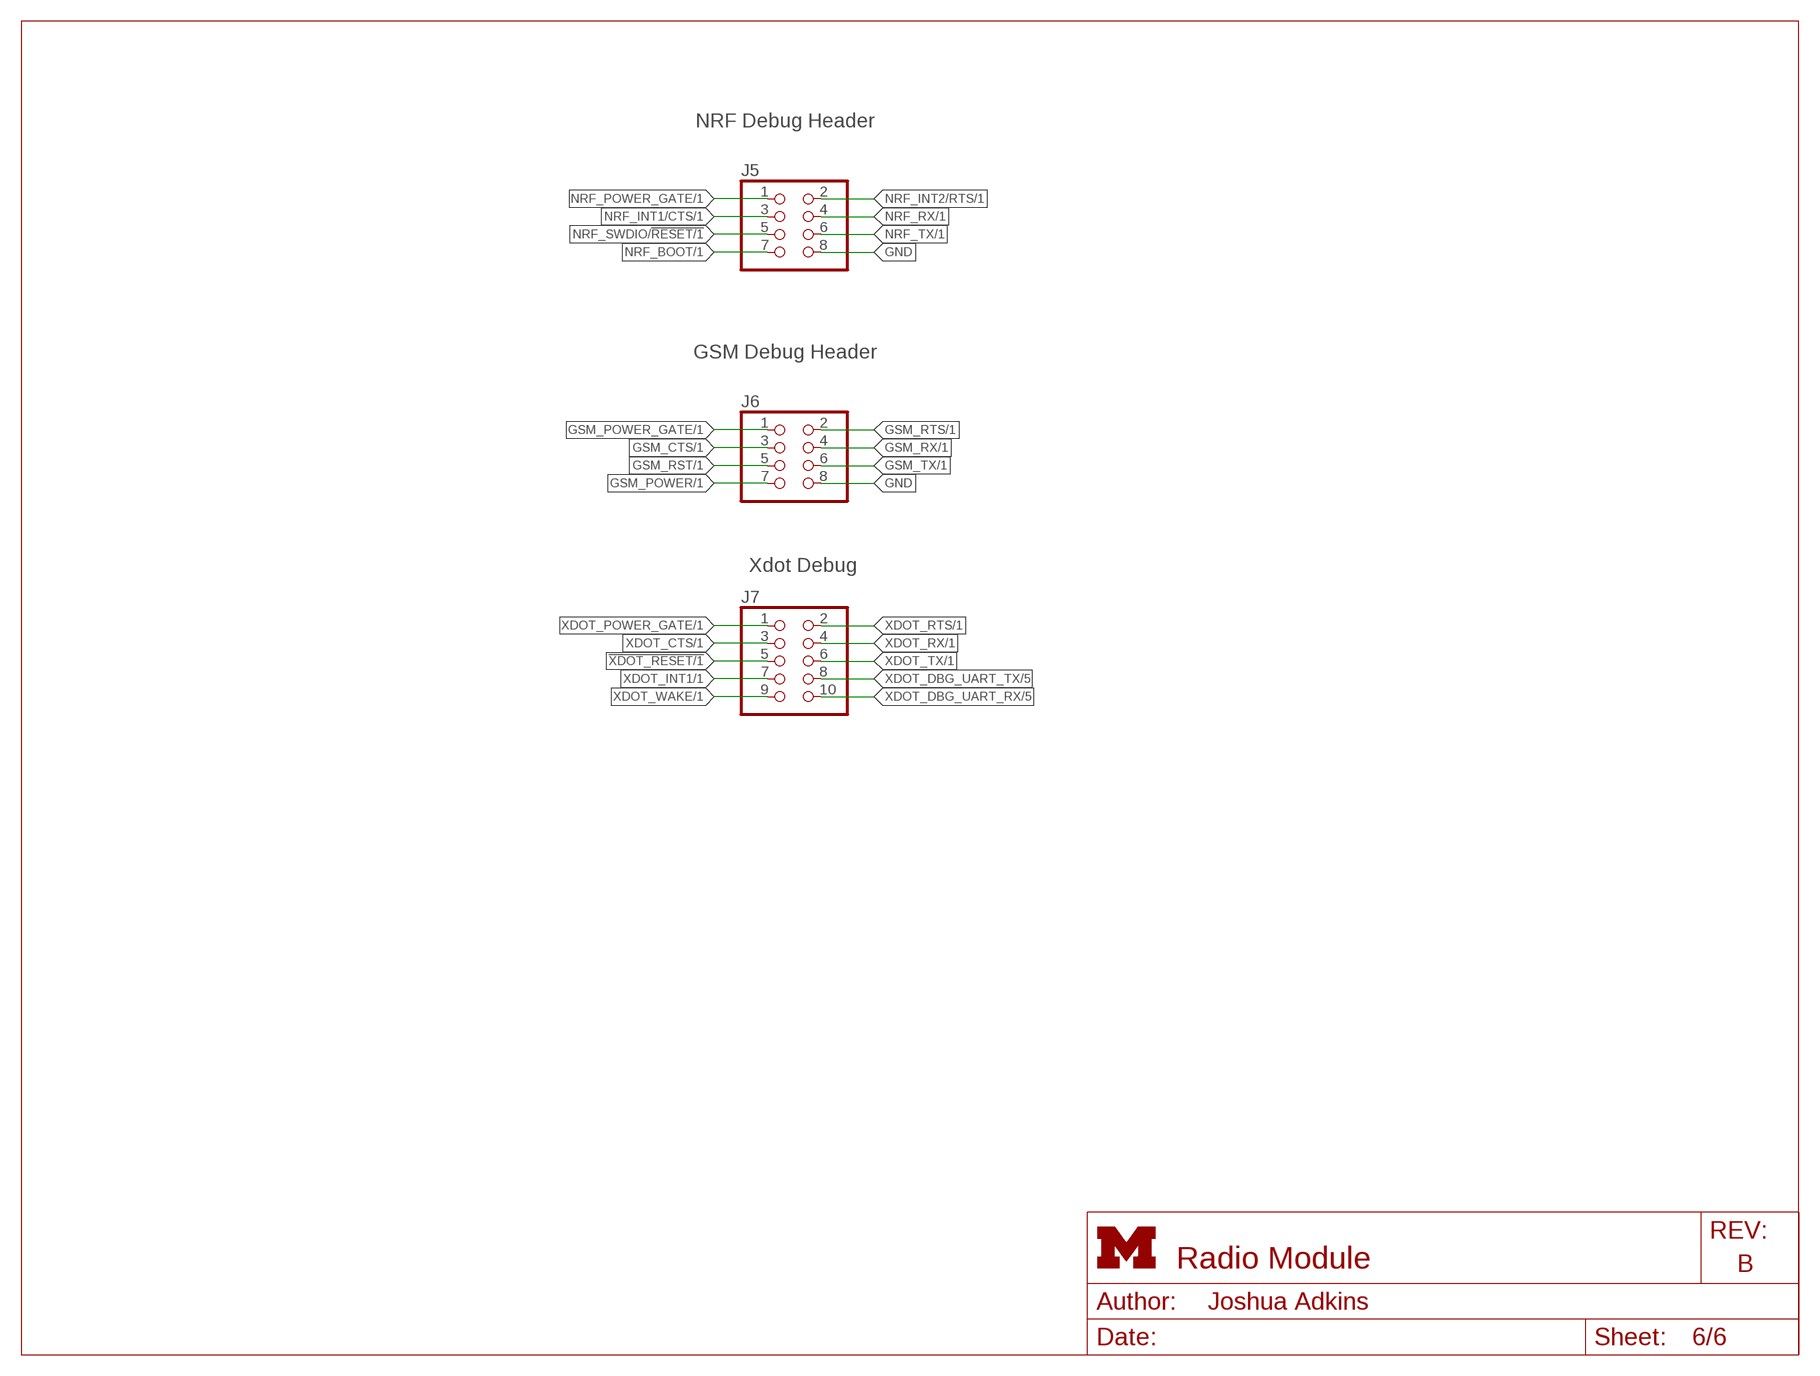
[diagram p5: schematic, sheet 6]
FRAME6 (LETTER_L_UMICH): HEIGHT: 8.5in; WIDTH: 11in

### Parts
J5  PINHD-2X4  [2X04]
J6  PINHD-2X4  [2X04]
J7  PINHD-2X5  [2X05]

### Nets
!XDOT_RESET: J7.5 ; also sheet 1,5
GND: J5.8 J6.8 ; also sheet 1,2,3,4,5
GSM_CTS: J6.3 ; also sheet 1,3
GSM_POWER: J6.7 ; also sheet 1,3
GSM_POWER_GATE: J6.1 ; also sheet 1,3
GSM_RST: J6.5 ; also sheet 1,3
GSM_RTS: J6.2 ; also sheet 1,3
GSM_RX: J6.4 ; also sheet 1,3
GSM_TX: J6.6 ; also sheet 1,3
NRF_BOOT: J5.7 ; also sheet 1,4
NRF_INT1/CTS: J5.3 ; also sheet 1,4
NRF_INT2/RTS: J5.2 ; also sheet 1,4
NRF_POWER_GATE: J5.1 ; also sheet 1,4
NRF_RX: J5.4 ; also sheet 1,4
NRF_SWDIO/!RESET: J5.5 ; also sheet 1,4
NRF_TX: J5.6 ; also sheet 1,4
XDOT_CTS: J7.3 ; also sheet 1,5
XDOT_DBG_UART_RX: J7.10 ; also sheet 5
XDOT_DBG_UART_TX: J7.8 ; also sheet 5
XDOT_INT1: J7.7 ; also sheet 1,5
XDOT_POWER_GATE: J7.1 ; also sheet 1,5
XDOT_RTS: J7.2 ; also sheet 1,5
XDOT_RX: J7.4 ; also sheet 1,5
XDOT_TX: J7.6 ; also sheet 1,5
XDOT_WAKE: J7.9 ; also sheet 1,5

### Notes on the sheet
- NRF Debug Header
- GSM Debug Header
- Xdot Debug

## Library data of the parts
A1 = chips:FRACTUS-2.4GHZ-FR05-S1-N-0-102: Fractus Compact Reach XtendTM chip antenna is engineered specifically for Bluetooth, WLAN 802.11 b/g/n and other wireless devices operating at the ISM 2.4 GHz band. Compact Reach Xtend combines small form factor size and high performance to improve the functionality of your wireless devices.; RICHARDSON_RFPD: FR05-S1-N-0102B
B1 = chips:BAL-NRF01D3: 50 ohm nominal input / conjugate match balun to nRF51422-QFAA, nRF24LE1, nRF51822-QFAA/AB, with integrated harmonic filter; DIGIKEY: 497-13637-1-ND; MOUSER: 511-BAL-NRF01D3
C1 = passives:CAPACITOR: SMD Capacitor; DIGIKEY: 490-6269-1-ND
C2 C3 = passives:CAPACITOR: SMD Capacitor; DIGIKEY: 490-8230-1-ND
C4-C7 = passives:CAPACITOR: SMD Capacitor; DIGIKEY: 490-6197-1-ND
C8 = passives:CAPACITOR: SMD Capacitor; DIGIKEY: 712-1342-1-ND
C9-C12 = passives:CAPACITOR: SMD Capacitor; DIGIKEY: 490-6241-1-ND
C13 = passives:CAPACITOR: SMD Capacitor; DIGIKEY: 490-1288-1-ND
C14 C15 = passives:CAPACITOR: SMD Capacitor; DIGIKEY: 490-1303-1-ND
C16 = passives:CAPACITOR: SMD Capacitor; DIGIKEY: 490-5419-1-ND
C17 C18 = passives:CAPACITOR: SMD Capacitor; DIGIKEY: 490-3248-1-ND
C19 = passives:CAPACITOR: SMD Capacitor; DIGIKEY: 490-4516-1-ND
C20 = passives:CAPACITOR: SMD Capacitor; DIGIKEY: 490-3254-1-ND
C21-C29 = passives:CAPACITOR: SMD Capacitor; DIGIKEY: 490-10777-1-ND
C30 = passives:CAPACITOR: SMD Capacitor; DIGIKEY: 490-1320-1-ND
C31 C32 = passives:CAPACITOR: SMD Capacitor; DIGIKEY: 490-13252-1-ND
C33-C35 = passives:CAPACITOR: SMD Capacitor; DIGIKEY: 490-13233-1-ND
C36 C37 = passives:CAPACITOR: SMD Capacitor; DIGIKEY: 1276-6834-1-ND
C38 = passives:CAPACITOR: SMD Capacitor; DIGIKEY: 490-13981-1-ND
C39 = passives:CAPACITOR: SMD Capacitor; DIGIKEY: 1276-3375-1-ND
D1-D4 = passives:DIODE_ZENER; DIGIKEY: PESD0402-140CT-ND
FB1 = passives:FERRITE_BEAD; DIGIKEY: 445-2158-1-ND
J1 = signpost:MODULE_GENERIC_DEBUG: The debug version of the signpost module header; DIGIKEY1: S9170-ND; DIGIKEY2: WM17450-ND; MF1: Sullins; MF2: Molex; MFN1: SBH11-PBPC-D07-ST-BK; MFN2: 0015912080
J2 J3 = connector:MOLEX_73251-135X: SMA JACK SMT 50 OHM; DIGIKEY: WM9357-ND; MF: Molex; MFN: 0732511350
J4 = signpost:NANO_SIM: WURTH Nano SIM Connector; DIGIKEY: 732-5954-1-ND
J5 J6 = pinhead:PINHD-2X4: PIN HEADER; DIGIKEY: 952-2123-ND
J7 = pinhead:PINHD-2X5: PIN HEADER; DIGIKEY: 609-3243-ND
J8-J10 = connector:TC2030-JLINK
J11 J12 = connector:U.FL-R-SMT: U.FL-R-SMT Antenna Connector; DIGIKEY: H122041-ND; MF: Hirose; MFN: U.FL-R-SMT-1(01)
L1 = passives:INDUCTOR: A very specific inductor; DIGIKEY: 587-1521-1-ND
L2 L3 = passives:INDUCTOR: A very specific inductor; DIGIKEY: 541-1322-1-ND; MF: Vishay Dale; MFN: IHLP1212BZER2R2M11
L4 = passives:INDUCTOR: A very specific inductor; DIGIKEY: 490-4025-1-ND
L5 = signpost:LHQ3NP: LHQ3NP Inductor; DIGIKEY: 490-5350-1-ND
LED1 LED2 = leds:LED: LED; DIGIKEY: 511-1578-1-ND
LED3 = SparkFun-LED:LED: LEDs Standard schematic elements and footprints for 5mm, 3mm, 1206, and 0603 sized LEDs. 5mm - Spark Fun Electronics SKU : COM-00529 (and others); DIGIKEY: 511-1578-1-ND
LED4 = leds:SML-LX0404SIUPGUSB: 1mm^2 RGB LED; DIGIKEY: 67-2125-1-ND
Q1-Q3 = fets:MOSFET-NCHANNEL: Generic NMOS footprint; DIGIKEY: 2N7002LT1GOSCT-ND
Q4-Q6 = fets:SI223DDS: 6A SOT-23 P Fet; DIGIKEY: SI2333DDS-T1-GE3CT-ND
R1-R3 = passives:RESISTOR: Resistor Basic schematic elements and footprints for 0603, 1206, and PTH resistors.; DIGIKEY: 311-0.0JRCT-ND
R4 = passives:RESISTOR: Resistor Basic schematic elements and footprints for 0603, 1206, and PTH resistors.; DIGIKEY: 408-1406-1-ND
R5 = passives:RESISTOR: Resistor Basic schematic elements and footprints for 0603, 1206, and PTH resistors.; DIGIKEY: P.43AKCT-ND
R6 = passives:RESISTOR: Resistor Basic schematic elements and footprints for 0603, 1206, and PTH resistors.; DIGIKEY: 541-3.32LLCT-ND
R7-R9 = passives:RESISTOR: Resistor Basic schematic elements and footprints for 0603, 1206, and PTH resistors.; DIGIKEY: 311-100LRCT-ND
R10 = passives:RESISTOR: Resistor Basic schematic elements and footprints for 0603, 1206, and PTH resistors.; DIGIKEY: RHM150CDCT-ND
R11-R16 = passives:RESISTOR: Resistor Basic schematic elements and footprints for 0603, 1206, and PTH resistors.; DIGIKEY: 311-1.0KJRCT-ND
R17 R19-R31 = passives:RESISTOR: Resistor Basic schematic elements and footprints for 0603, 1206, and PTH resistors.; DIGIKEY: 311-10KJRCT-ND
R18 = passives:RESISTOR: Resistor Basic schematic elements and footprints for 0603, 1206, and PTH resistors.; DIGIKEY: 311-10KJRCT-ND; DNP: DNP
R32 = passives:RESISTOR: Resistor Basic schematic elements and footprints for 0603, 1206, and PTH resistors.; DIGIKEY: RHM12.0KCDCT-ND
R33-R41 = passives:RESISTOR: Resistor Basic schematic elements and footprints for 0603, 1206, and PTH resistors.; DIGIKEY: 311-100KLRCT-ND
R42 = passives:RESISTOR: Resistor Basic schematic elements and footprints for 0603, 1206, and PTH resistors.; DIGIKEY: P200KLCT-ND
R43 = passives:RESISTOR: Resistor Basic schematic elements and footprints for 0603, 1206, and PTH resistors.; DIGIKEY: YAG3291CT-ND
R44 R45 = passives:RESISTOR: Resistor Basic schematic elements and footprints for 0603, 1206, and PTH resistors.; DIGIKEY: YAG3228CT-ND
S2 = switches:B3U: Switch; DIGIKEY: SW1020CT-ND; MF: Omron; MFN: B3U-1000P
TP1-TP4 = headers:TEST_POINT_0.040IN: 0.040in Test Point; DIGIKEY: 5001K-ND
U1-U3 = signpost:LTC2941: I2C Battery Gas Gauge with External Sense Resistor; DIGIKEY: LTC2941IDCB#TRMPBFCT-ND
U5 = signpost:PCA9544A: 1-4 I2C/SMBUS Multiplexer with interrupt for power supply coulomb counters; DIGIKEY: 296-20960-1-ND
U6 = chips:SAM4LC8BA: SAM4L Microcontroller. 64QFN Package. 512 Flash.; DIGIKEY: ATSAM4LC8BA-MU
U7 U8 = chips:TLV62130: High Efficient 3A switching step-down regulator. 1V-5V out, 4V-17V in.; DIGIKEY: 296-35978-1-ND; MF: Texas Instruments; MFN: TLV62130RGTR
U9 = chips:TXB0104RUT: 4-channel bidirectional level translater; DIGIKEY: 296-25888-1-ND
U10 = signpost:UBLOX_SARA_G350: Sara G350 2.5G Radio Module
U11 = signpost:XDOT_MODULE: Multitech XDOT LoRa Module
U13 = chips:NRF51822: Multiprotocol Bluetooth® 4.0 low energy/2.4 GHz RF SoC; DIGIKEY: 1490-1049-1-ND; MOUSER: 949-NRF51822-QFAC-R7
U$1 = logos:UCB_CAL
X1 = crystals:FH1600015: Pericom Type FH 16 MHz 2.5 x 2.0 mm; DIGIKEY: FH1600015CT-ND
X4 = crystals:TXC-8Y: 2mmx1.6mm SMD Crystal; DIGIKEY: 887-2003-1-ND
X5 = crystals:ABS05-32.768KHZ: 32.768kHz Crystal; DIGIKEY: 535-11897-1-ND; MF: Abracon; MFN: ABS05-32.768KHZ-9-T